# Altium schematic sheet ISL6236A.SchDoc
size A3; PageSetup: Record=PageOptions|CenterHorizontal=True|CenterVertical=True|PrintScale=0.70|XCorrection=1.00|YCorrection=1.00|PrintKind=0|BorderSize=5000000|LeftOffset=0|BottomOffset=0|Orientation=2|PaperLength=1000|PaperWidth=1000|Scale=100|PaperSource=7|PrintQuality=-4|MediaType=1|DitherType=10|PaperKind=Letter|PrintScaleMode=1
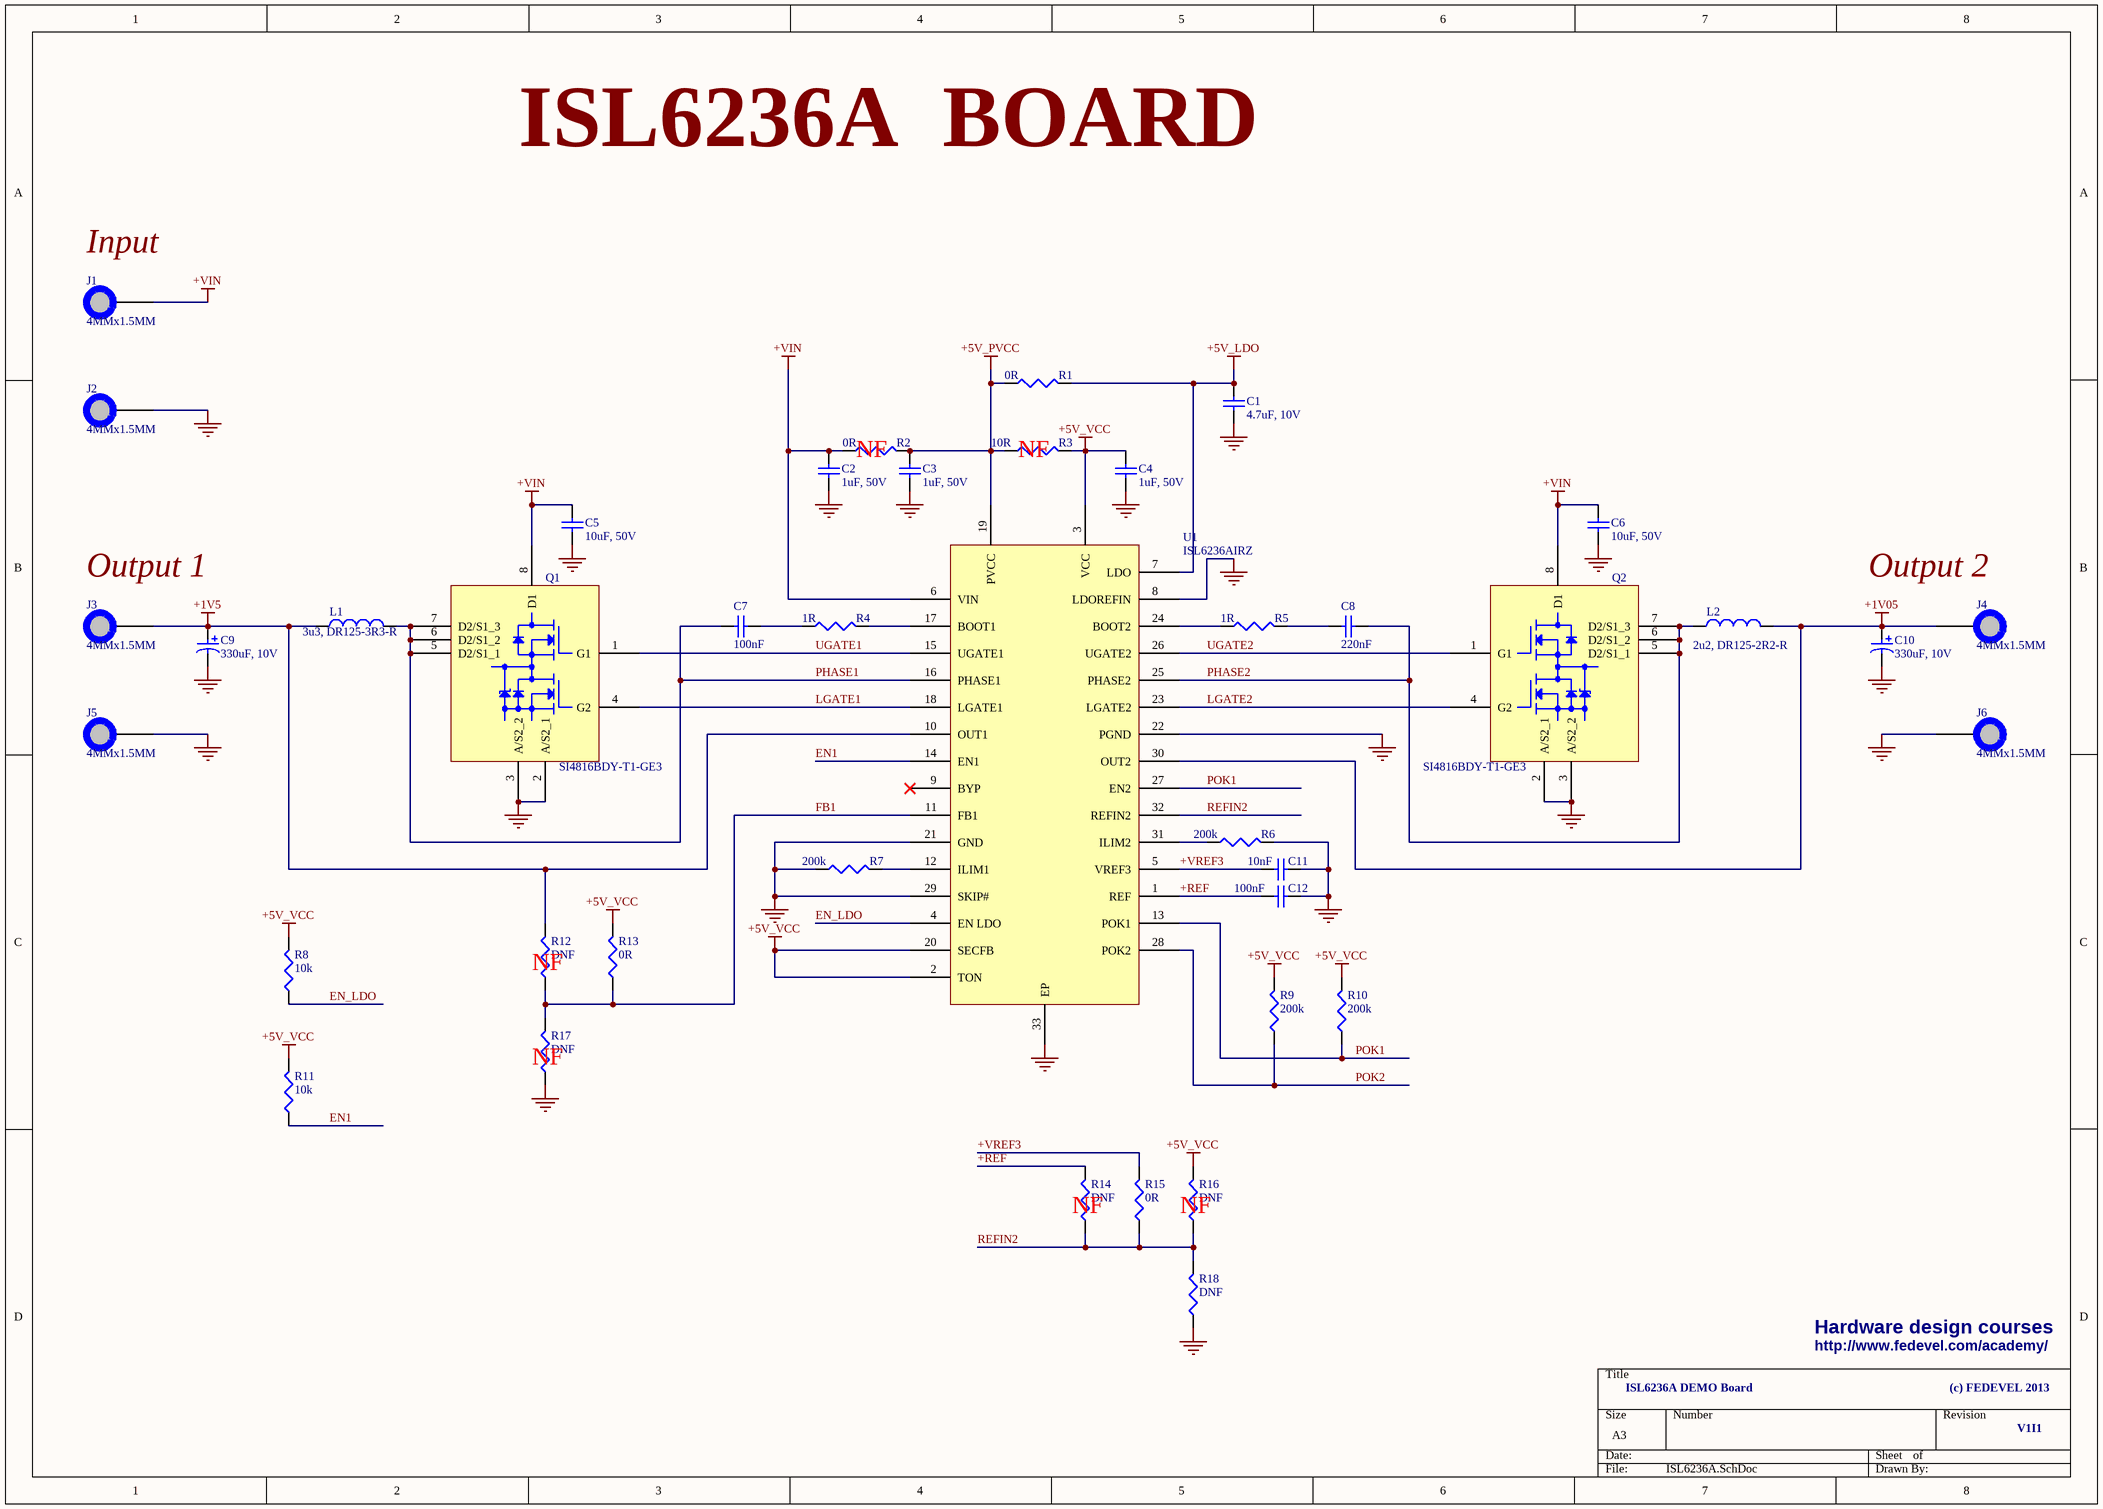
[diagram p0: ISL6236A.SchDoc]

## Parts
C1  4.7uF, 10V  [C1206]
C2  1uF, 50V  [C0805]
C3  1uF, 50V  [C0805]
C4  1uF, 50V  [C0805]
C5  10uF, 50V  [C1210]
C6  10uF, 50V  [C1210]
C7  100nF  [C0805]
C8  220nF  [C0805]
C9  330uF, 10V  [7343-43]
C10  330uF, 10V  [7343-43]
C11  10nF  [C0805]
C12  100nF  [C0805]
J1  4MMx1.5MM  [PAD_WITH_HOLE_4MMx1.5MM]
J2  4MMx1.5MM  [PAD_WITH_HOLE_4MMx1.5MM]
J3  4MMx1.5MM  [PAD_WITH_HOLE_4MMx1.5MM]
J4  4MMx1.5MM  [PAD_WITH_HOLE_4MMx1.5MM]
J5  4MMx1.5MM  [PAD_WITH_HOLE_4MMx1.5MM]
J6  4MMx1.5MM  [PAD_WITH_HOLE_4MMx1.5MM]
L1  3u3, DR125-3R3-R  [DR125]
L2  2u2, DR125-2R2-R  [DR125]
Q1  SI4816BDY-T1-GE3  [SO-8]
Q2  SI4816BDY-T1-GE3  [SO-8]
R1  0R  [R0805]
R2  0R  [R0805]
R3  10R  [R0805]
R4  1R  [R0805]
R5  1R  [R0805]
R6  200k  [R0805]
R7  200k  [R0805]
R8  10k  [R0805]
R9  200k  [R0805]
R10  200k  [R0805]
R11  10k  [R0805]
R12  DNF  [R0805]
R13  0R  [R0805]
R14  DNF  [R0805]
R15  0R  [R0805]
R16  DNF  [R0805]
R17  DNF  [R0805]
R18  DNF  [R0805]
U1  ISL6236AIRZ  [L32.5x5B]

## Nets
+1V5: C9.1 J3.1 L1.1 R12.2 U1.10(OUT1)
+1V05: C10.1 J4.1 L2.2 U1.30(OUT2)
+5V_LDO: C1.2 R1.2 U1.7(LDO)
+5V_PVCC: C3.2 R1.1 R2.2 R3.1 U1.19(PVCC)
+5V_VCC: C4.2 R3.2 R8.2 R9.2 R10.2 R11.2 R13.2 R16.2 U1.2(TON) U1.3(VCC) U1.20(SECFB)
+VIN: C2.2 C5.2 C6.2 J1.1 Q1.8(D1) Q2.8(D1) R2.1 U1.6(VIN)
GND: C1.1 C2.1 C3.1 C4.1 C5.1 C6.1 C9.2 C10.2 C11.2 C12.2 J2.1 J5.1 J6.1 Q1.2(A/S2_1) Q1.3(A/S2_2) Q2.2(A/S2_1) Q2.3(A/S2_2) R6.2 R7.1 R17.1 R18.1 U1.8(LDOREFIN) U1.21(GND) U1.22(PGND) U1.29(SKIP#) U1.33(EP)
+REF: C12.1 R14.2 U1.1(REF)
+VREF3: C11.1 R15.2 U1.5(VREF3)
EN1: R11.1 U1.14(EN1)
EN_LDO: R8.1 U1.4(EN_LDO)
FB1: R12.1 R13.1 R17.2 U1.11(FB1)
LGATE1: Q1.4(G2) U1.18(LGATE1)
LGATE2: Q2.4(G2) U1.23(LGATE2)
PHASE1: C7.1 L1.2 Q1.5(D2/S1_1) Q1.6(D2/S1_2) Q1.7(D2/S1_3) U1.16(PHASE1)
PHASE2: C8.2 L2.1 Q2.5(D2/S1_1) Q2.6(D2/S1_2) Q2.7(D2/S1_3) U1.25(PHASE2)
POK1: R10.1 U1.13(POK1) U1.27(EN2)
POK2: R9.1 U1.28(POK2)
REFIN2: R14.1 R15.1 R16.1 R18.2 U1.32(REFIN2)
UGATE1: Q1.1(G1) U1.15(UGATE1)
UGATE2: Q2.1(G1) U1.26(UGATE2)
NetC7_2: C7.2 R4.1
NetC8_1: C8.1 R5.2
NetR4_2: R4.2 U1.17(BOOT1)
NetR5_1: R5.1 U1.24(BOOT2)
NetR6_1: R6.1 U1.31(ILIM2)
NetR7_2: R7.2 U1.12(ILIM1)

Not connected (* = marked no-connect by the designer): U1 9(BYP)*

## Notes on the sheet
- ISL6236A  BOARD
- (near J1) Input
- (near R2) NF
- (near R3) NF
- Output 1
- Output 2
- (near R12) NF
- (near R17) NF
- (near R14) NF
- (near R16) NF
- Hardware design courses
- ISL6236A DEMO Board
- http://www.fedevel.com/academy/
- (c) FEDEVEL 2013
- V1I1

## Library data of the parts
C1 = C3216X5R1A475K: CAP CER 4.7UF 10V 10% X5R 1206; Manufacturer: TDK Corporation; Capacitance: 4.7µF; Supplier 1: Digi-Key; Manufacturer Part Number: C3216X5R1A475K; RoHS: RoHS Compliant; Category: Capacitors; Stock 1: 357412; Pricing 1: 1=0.25, 10=0.173, 100=0.0882, 250=0.0714, 500=0.063, 1000=0.05355 (USD); Packaging: Cut Tape (CT); Voltage - Rated: 10V; Tolerance: ±10%; Temperature Coefficient: X5R; Mounting Type: Surface Mount, MLCC; Operating Temperature: -55°C ~ 85°C; Applications: General Purpose; Ratings: -; Package / Case: 1206 (3216 Metric); Size / Dimension: 0.126" L x 0.063" W (3.20mm x 1.60mm); Height - Seated (Max): -; Thickness (Max): 0.071" (1.80mm); Lead Spacing: -; Features: -; Lead Style: -; ComponentLink1URL: http://media.digikey.com/pdf/Data%20Sheets/TDK%20PDFs/C_Series_GeneralAppl_B11.pdf; ComponentLink1Description: http://media.digikey.com/pdf/Data%20Sheets/TDK%20PDFs/C_Series_GeneralAppl_B11.pdf; Supplier Part Number 1: 445-1386-1-ND
C2-C4 = C2012X7R1H105K125AB: CAP CER 1UF 50V 10% X7R 0805; Manufacturer: TDK Corporation; Capacitance: 1.0µF; Supplier 1: Digi-Key; Manufacturer Part Number: C2012X7R1H105K125AB; RoHS: RoHS Compliant; Category: Capacitors; Stock 1: 39703; Pricing 1: 1=0.36, 10=0.315, 100=0.1575, 250=0.126, 500=0.11476, 1000=0.1035 (USD); Packaging: Cut Tape (CT); Voltage - Rated: 50V; Tolerance: ±10%; Temperature Coefficient: X7R; Mounting Type: Surface Mount, MLCC; Operating Temperature: -55°C ~ 125°C; Applications: General Purpose; Ratings: -; Package / Case: 0805 (2012 Metric); Size / Dimension: 0.079" L x 0.049" W (2.00mm x 1.25mm); Height - Seated (Max): -; Thickness (Max): 0.057" (1.45mm); Lead Spacing: -; Features: -; Lead Style: -; ComponentLink1URL: http://product.tdk.com/capacitor/mlcc/en/documents/mlcc_commercial_general_en.pdf; ComponentLink1Description: http://product.tdk.com/capacitor/mlcc/en/documents/mlcc_commercial_general_en.pdf; Supplier Part Number 1: 445-7547-1-ND
C5 C6 = UMK325BJ106MM-T: CAP CER 10UF 50V 20% X5R 1210; Manufacturer: Taiyo Yuden; Capacitance: 10µF; Supplier 1: Digi-Key; Manufacturer Part Number: UMK325BJ106MM-T; RoHS: RoHS Compliant; Category: Capacitors; Stock 1: 269508; Pricing 1: 1=0.56, 10=0.536, 50=0.32, 100=0.26, 250=0.216 (USD); Packaging: Cut Tape (CT); Voltage - Rated: 50V; Tolerance: ±20%; Temperature Coefficient: X5R; Mounting Type: Surface Mount, MLCC; Operating Temperature: -55°C ~ 85°C; Applications: General Purpose; Ratings: -; Package / Case: 1210 (3225 Metric); Size / Dimension: 0.126" L x 0.098" W (3.20mm x 2.50mm); Height - Seated (Max): -; Thickness (Max): 0.106" (2.70mm); Lead Spacing: -; Features: -; Lead Style: -; ComponentLink1URL: http://www.yuden.co.jp/or/product/category/capacitor/UMK325BJ106MM-T.pdf; ComponentLink1Description: http://www.yuden.co.jp/or/product/category/capacitor/UMK325BJ106MM-T.pdf; Supplier Part Number 1: 587-2225-1-ND
C7 C12 = C2012X7R1H104K085AA: CAP CER 0.1UF 50V 10% X7R 0805; Manufacturer: TDK Corporation; Capacitance: 0.1µF; Supplier 1: Digi-Key; Manufacturer Part Number: C2012X7R1H104K085AA; RoHS: RoHS Compliant; Category: Capacitors; Stock 1: 76453; Pricing 1: 1=0.1, 10=0.066, 100=0.0303, 250=0.02476, 500=0.02118, 1000=0.0165 (USD); Packaging: Cut Tape (CT); Voltage - Rated: 50V; Tolerance: ±10%; Temperature Coefficient: X7R; Mounting Type: Surface Mount, MLCC; Operating Temperature: -55°C ~ 125°C; Applications: General Purpose; Ratings: -; Package / Case: 0805 (2012 Metric); Size / Dimension: 0.079" L x 0.049" W (2.00mm x 1.25mm); Height - Seated (Max): -; Thickness (Max): 0.037" (0.95mm); Lead Spacing: -; Features: -; Lead Style: -; ComponentLink1URL: http://product.tdk.com/capacitor/mlcc/en/documents/mlcc_commercial_general_en.pdf; ComponentLink1Description: http://product.tdk.com/capacitor/mlcc/en/documents/mlcc_commercial_general_en.pdf; Supplier Part Number 1: 445-7534-1-ND
C8 = C2012X7R1H224K125AA: CAP CER 0.22UF 50V 10% X7R 0805; Manufacturer: TDK Corporation; Capacitance: 0.22µF; Supplier 1: Digi-Key; Manufacturer Part Number: C2012X7R1H224K125AA; RoHS: RoHS Compliant; Category: Capacitors; Stock 1: 335403; Pricing 1: 1=0.14, 10=0.095, 100=0.0451, 250=0.038, 500=0.03182, 1000=0.02613 (USD); Packaging: Cut Tape (CT); Voltage - Rated: 50V; Tolerance: ±10%; Temperature Coefficient: X7R; Mounting Type: Surface Mount, MLCC; Operating Temperature: -55°C ~ 125°C; Applications: General Purpose; Ratings: -; Package / Case: 0805 (2012 Metric); Size / Dimension: 0.079" L x 0.049" W (2.00mm x 1.25mm); Height - Seated (Max): -; Thickness (Max): 0.057" (1.45mm); Lead Spacing: -; Features: -; Lead Style: -; ComponentLink1URL: http://product.tdk.com/capacitor/mlcc/en/documents/mlcc_commercial_general_en.pdf; ComponentLink1Description: http://product.tdk.com/capacitor/mlcc/en/documents/mlcc_commercial_general_en.pdf; Supplier Part Number 1: 445-1350-1-ND
C9 C10 = T530X337M010ATE004: CAP TANT 330UF 10V 20% 2917; Manufacturer: Kemet; Manufacturer Size Code: X; Capacitance: 330µF; ESR (Equivalent Series Resistance): 4 mOhm; Type: Molded; Supplier 1: Digi-Key; Manufacturer Part Number: T530X337M010ATE004; RoHS: RoHS Compliant; Category: Capacitors; Stock 1: 4467; Pricing 1: 1=8.22, 10=7.685, 50=7.2876, 100=6.625, 250=5.69752 (USD); Packaging: Cut Tape (CT); Voltage - Rated: 10V; Tolerance: ±20%; Operating Temperature: -55°C ~ 125°C; Mounting Type: Surface Mount; Package / Case: 2917 (7343 Metric); Size / Dimension: 0.287" L x 0.169" W (7.30mm x 4.30mm); Height - Seated (Max): 0.169" (4.30mm); Lead Spacing: -; Features: Polymer; Lifetime @ Temp.: -; ComponentLink1URL: http://www.kemet.com/datasheets&T530X337M010ATE004; ComponentLink1Description: http://www.kemet.com/datasheets&T530X337M010ATE004; Supplier Part Number 1: 399-10378-1-ND
C11 = VJ0805Y103KNAAO: CAP CER 10000PF 50V 10% X7R 0805; Manufacturer: Vishay Vitramon; Supplier 1: Digi-Key; Manufacturer Part Number: VJ0805Y103KNAAO; RoHS: RoHS Compliant; Category: Capacitors; Stock 1: 5806; Pricing 1: 1=0.9, 10=0.866, 25=0.6136, 50=0.5168, 100=0.4199, 250=0.34884, 500=0.31654, 1000=0.2907 (USD); Packaging: Cut Tape (CT); Capacitance: 10000pF; Voltage - Rated: 50V; Tolerance: ±10%; Temperature Coefficient: X7R; Mounting Type: Surface Mount, MLCC; Operating Temperature: -55°C ~ 125°C; Applications: General Purpose; Ratings: -; Package / Case: 0805 (2012 Metric); Size / Dimension: 0.079" L x 0.049" W (2.00mm x 1.25mm); Height - Seated (Max): -; Thickness (Max): 0.057" (1.45mm); Lead Spacing: -; Features: Non-Magnetic; Lead Style: -; ComponentLink1URL: http://www.vishay.com/docs/45128/vjnonmagneticseries.pdf; ComponentLink1Description: http://www.vishay.com/docs/45128/vjnonmagneticseries.pdf; Supplier Part Number 1: 720-1244-1-ND
J1-J6 = PAD_WITH_HOLE_4MMx1.5MM: Pad with a hole 4mm x 1.5mm
L1 = DR125-3R3-R: INDUCTOR SHIELD PWR 3.3UH SMD; Manufacturer: Cooper Bussmann; Type: Ferrite Core; Inductance: 3.3µH; Current Rating: 9.26A; Current - Saturation: 12.7A; Tolerance: ±20%; Material - Core: Ferrite; Shielding: Shielded; DC Resistance (DCR): 6.3 mOhm; Frequency - Test: 100kHz; Supplier 1: Digi-Key; Manufacturer Part Number: DR125-3R3-R; RoHS: RoHS Compliant; Category: Inductors, Coils, Chokes; Stock 1: 208; Pricing 1: 1=1.91, 10=1.785, 50=1.4536, 100=1.326 (USD); Packaging: Cut Tape (CT); Q @ Freq: -; Frequency - Self Resonant: -; Operating Temperature: -40°C ~ 125°C; Package / Case: Non Standard; Size / Dimension: 0.492" L x 0.492" W x 0.236" H (12.50mm x 12.50mm x 6.00mm); Mounting Type: Surface Mount; ComponentLink1URL: http://www.cooperindustries.com/content/dam/public/bussmann/Electronics/Resources/Data%20Sheets/Bus_Elx_DS_4315_DR_Series.pdf; ComponentLink1Description: http://www.cooperindustries.com/content/dam/public/bussmann/Electronics/Resources/Data%20Sheets/Bus_Elx_DS_4315_DR_Series.pdf; Supplier Part Number 1: 513-1529-1-ND
L2 = DR125-2R2-R: INDUCTOR SHIELD PWR 2.2UH SMD; Manufacturer: Cooper Bussmann; Type: Ferrite Core; Inductance: 2.2µH; Current Rating: 10.9A; Current - Saturation: 15A; Tolerance: ±20%; Material - Core: Ferrite; Shielding: Shielded; DC Resistance (DCR): 4.5 mOhm; Frequency - Test: 100kHz; Supplier 1: Digi-Key; Manufacturer Part Number: DR125-2R2-R; RoHS: RoHS Compliant; Category: Inductors, Coils, Chokes; Stock 1: 1561; Pricing 1: 1=1.91, 10=1.785, 50=1.4536, 100=1.326 (USD); Packaging: Cut Tape (CT); Q @ Freq: -; Frequency - Self Resonant: -; Operating Temperature: -40°C ~ 125°C; Package / Case: Non Standard; Size / Dimension: 0.492" L x 0.492" W x 0.236" H (12.50mm x 12.50mm x 6.00mm); Mounting Type: Surface Mount; ComponentLink1URL: http://www.cooperindustries.com/content/dam/public/bussmann/Electronics/Resources/Data%20Sheets/Bus_Elx_DS_4315_DR_Series.pdf; ComponentLink1Description: http://www.cooperindustries.com/content/dam/public/bussmann/Electronics/Resources/Data%20Sheets/Bus_Elx_DS_4315_DR_Series.pdf; Supplier Part Number 1: 513-1662-1-ND
Q1 Q2 = SI4816BDY-T1-GE3: MOSFET DL N-CH 30V 6.8A 8-SOIC; Manufacturer: Vishay Siliconix; FET Type: 2 N-Channel (Dual); FET Feature: Logic Level Gate; Current - Continuous Drain (Id) @ 25° C: 5.8A, 8.2A; Rds On (Max) @ Id, Vgs: 18.5 mOhm @ 6.8A, 10V; Vgs(th) (Max) @ Id: 3V @ 250µA; Gate Charge (Qg) @ Vgs: 10nC @ 5V; Power - Max: 1W, 1.25W; Supplier 1: Digi-Key; Manufacturer Part Number: SI4816BDY-T1-GE3; RoHS: RoHS Compliant; Category: Discrete Semiconductor Products; Stock 1: 15907; Pricing 1: 1=1.84, 25=1.4228, 100=1.2912, 250=1.1594, 500=1.0013, 1000=0.8432 (USD); Packaging: Cut Tape (CT); Drain to Source Voltage (Vdss): 30V; Input Capacitance (Ciss) @ Vds: -; Mounting Type: Surface Mount; Package / Case: 8-SOIC (0.154", 3.90mm Width); Supplier Device Package: 8-SOIC N; ComponentLink1URL: http://www.vishay.com/docs/73026/si4816bd.pdf; ComponentLink1Description: http://www.vishay.com/docs/73026/si4816bd.pdf; Supplier Part Number 1: SI4816BDY-T1-GE3CT-ND
R1 R2 R13 R15 = ERJ-6GEY0R00V: RES 0.0 OHM 1/8W JUMP 0805 SMD; Manufacturer: Panasonic Electronic Components; Resistance (Ohms): 0.0; Power (Watts): 0.125W, 1/8W; Tolerance: Jumper; Supplier 1: Digi-Key; Manufacturer Part Number: ERJ-6GEY0R00V; RoHS: RoHS Compliant; Category: Resistors; Stock 1: 1205673; Pricing 1: 1=0.05, 50=0.0172, 100=0.0131, 250=0.00976, 500=0.0072, 1000=0.0048 (USD); Packaging: Cut Tape (CT); Composition: Thick Film; Features: -; Temperature Coefficient: -; Package / Case: 0805 (2012 Metric); Supplier Device Package: 0805; Size / Dimension: 0.079" L x 0.049" W (2.00mm x 1.25mm); Height: 0.028" (0.70mm); Number of Terminations: 2; ComponentLink1URL: http://industrial.panasonic.com/www-cgi/jvcr13pz.cgi?E+PZ+3+AOA0001+ERJ6GEY0R00V+7+WW; ComponentLink1Description: http://industrial.panasonic.com/www-cgi/jvcr13pz.cgi?E+PZ+3+AOA0001+ERJ6GEY0R00V+7+WW; Supplier Part Number 1: P0.0ACT-ND
R3 = ERJ-6GEYJ100V: RES 10 OHM 1/8W 5% 0805 SMD; Manufacturer: Panasonic Electronic Components; Resistance (Ohms): 10; Power (Watts): 0.125W, 1/8W; Temperature Coefficient: ±200ppm/°C; Supplier 1: Digi-Key; Manufacturer Part Number: ERJ-6GEYJ100V; RoHS: RoHS Compliant; Category: Resistors; Stock 1: 694384; Pricing 1: 1=0.1, 50=0.0162, 100=0.0122, 250=0.00908, 500=0.00672, 1000=0.00448 (USD); Packaging: Cut Tape (CT); Composition: Thick Film; Features: -; Tolerance: ±5%; Package / Case: 0805 (2012 Metric); Supplier Device Package: 0805; Size / Dimension: 0.079" L x 0.049" W (2.00mm x 1.25mm); Height: 0.028" (0.70mm); Number of Terminations: 2; ComponentLink1URL: http://industrial.panasonic.com/www-cgi/jvcr13pz.cgi?E+PZ+3+AOA0001+ERJ6GEYJ100V+7+WW; ComponentLink1Description: http://industrial.panasonic.com/www-cgi/jvcr13pz.cgi?E+PZ+3+AOA0001+ERJ6GEYJ100V+7+WW; Supplier Part Number 1: P10ACT-ND
R4 R5 = ERJ-6RQF1R0V: RES 1 OHM 1/8W 1% 0805 SMD; Manufacturer: Panasonic Electronic Components; Resistance (Ohms): 1; Power (Watts): 0.125W, 1/8W; Temperature Coefficient: ±200ppm/°C; Supplier 1: Digi-Key; Manufacturer Part Number: ERJ-6RQF1R0V; RoHS: RoHS Compliant; Category: Resistors; Stock 1: 49078; Pricing 1: 1=0.57, 50=0.2266, 100=0.1748, 250=0.13596, 500=0.09584, 1000=0.06993 (USD); Packaging: Cut Tape (CT); Composition: Thick Film; Features: -; Tolerance: ±1%; Package / Case: 0805 (2012 Metric); Supplier Device Package: 0805; Size / Dimension: 0.079" L x 0.049" W (2.00mm x 1.25mm); Height: 0.028" (0.70mm); Number of Terminations: 2; ComponentLink1URL: http://industrial.panasonic.com/www-cgi/jvcr13pz.cgi?E+PZ+3+AOA0003+ERJ6RQF1R0V+7+WW; ComponentLink1Description: http://industrial.panasonic.com/www-cgi/jvcr13pz.cgi?E+PZ+3+AOA0003+ERJ6RQF1R0V+7+WW; Supplier Part Number 1: P1.0DCT-ND
R6 R7 R9 R10 = ERJ-6ENF2003V: RES 200K OHM 1/8W 1% 0805 SMD; Manufacturer: Panasonic Electronic Components; Power (Watts): 0.125W, 1/8W; Temperature Coefficient: ±100ppm/°C; Supplier 1: Digi-Key; Manufacturer Part Number: ERJ-6ENF2003V; RoHS: RoHS Compliant; Category: Resistors; Stock 1: 207346; Pricing 1: 1=0.1, 50=0.0276, 100=0.021, 250=0.0156, 500=0.01152, 1000=0.00768 (USD); Packaging: Cut Tape (CT); Resistance (Ohms): 200k; Composition: Thick Film; Features: -; Tolerance: ±1%; Package / Case: 0805 (2012 Metric); Supplier Device Package: 0805; Size / Dimension: 0.079" L x 0.049" W (2.00mm x 1.25mm); Height: 0.028" (0.70mm); Number of Terminations: 2; ComponentLink1URL: http://industrial.panasonic.com/www-cgi/jvcr13pz.cgi?E+PZ+3+AOA0002+ERJ6ENF2003V+7+WW; ComponentLink1Description: http://industrial.panasonic.com/www-cgi/jvcr13pz.cgi?E+PZ+3+AOA0002+ERJ6ENF2003V+7+WW; Supplier Part Number 1: P200KCCT-ND
R8 R11 = ERJ-6GEYJ103V: RES 10K OHM 1/8W 5% 0805 SMD; Manufacturer: Panasonic Electronic Components; Power (Watts): 0.125W, 1/8W; Temperature Coefficient: ±200ppm/°C; Supplier 1: Digi-Key; Manufacturer Part Number: ERJ-6GEYJ103V; RoHS: RoHS Compliant; Category: Resistors; Stock 1: 3003325; Pricing 1: 1=0.1, 50=0.0162, 100=0.0122, 250=0.00908, 500=0.00672, 1000=0.00448 (USD); Packaging: Cut Tape (CT); Resistance (Ohms): 10k; Composition: Thick Film; Features: -; Tolerance: ±5%; Package / Case: 0805 (2012 Metric); Supplier Device Package: 0805; Size / Dimension: 0.079" L x 0.049" W (2.00mm x 1.25mm); Height: 0.028" (0.70mm); Number of Terminations: 2; ComponentLink1URL: http://industrial.panasonic.com/www-cgi/jvcr13pz.cgi?E+PZ+3+AOA0001+ERJ6GEYJ103V+7+WW; ComponentLink1Description: http://industrial.panasonic.com/www-cgi/jvcr13pz.cgi?E+PZ+3+AOA0001+ERJ6GEYJ103V+7+WW; Supplier Part Number 1: P10KACT-ND
R12 R14 R16-R18 = RES
U1 = ISL6236AIRZ: IC MAIN PWR CTRLR QUAD 32-QFN; Manufacturer: Intersil; Voltage - Input: 4.5 V ~ 25 V; Number of Outputs: 4; Voltage - Output: Multiple; Supplier 1: Digi-Key; Manufacturer Part Number: ISL6236AIRZ; RoHS: RoHS Compliant; Category: Integrated Circuits (ICs); Stock 1: 0; Pricing 1: 600=4.28 (USD); Packaging: Tube; Applications: Controller, Notebook Power System; Operating Temperature: -40°C ~ 100°C; Mounting Type: Surface Mount; Package / Case: 32-VFQFN Exposed Pad; Supplier Device Package: 32-QFN Exposed Pad (5x5); ComponentLink1URL: http://www.intersil.com/content/dam/Intersil/documents/fn64/fn6453.pdf; ComponentLink1Description: http://www.intersil.com/content/dam/Intersil/documents/fn64/fn6453.pdf; Supplier Part Number 1: ISL6236AIRZ-ND